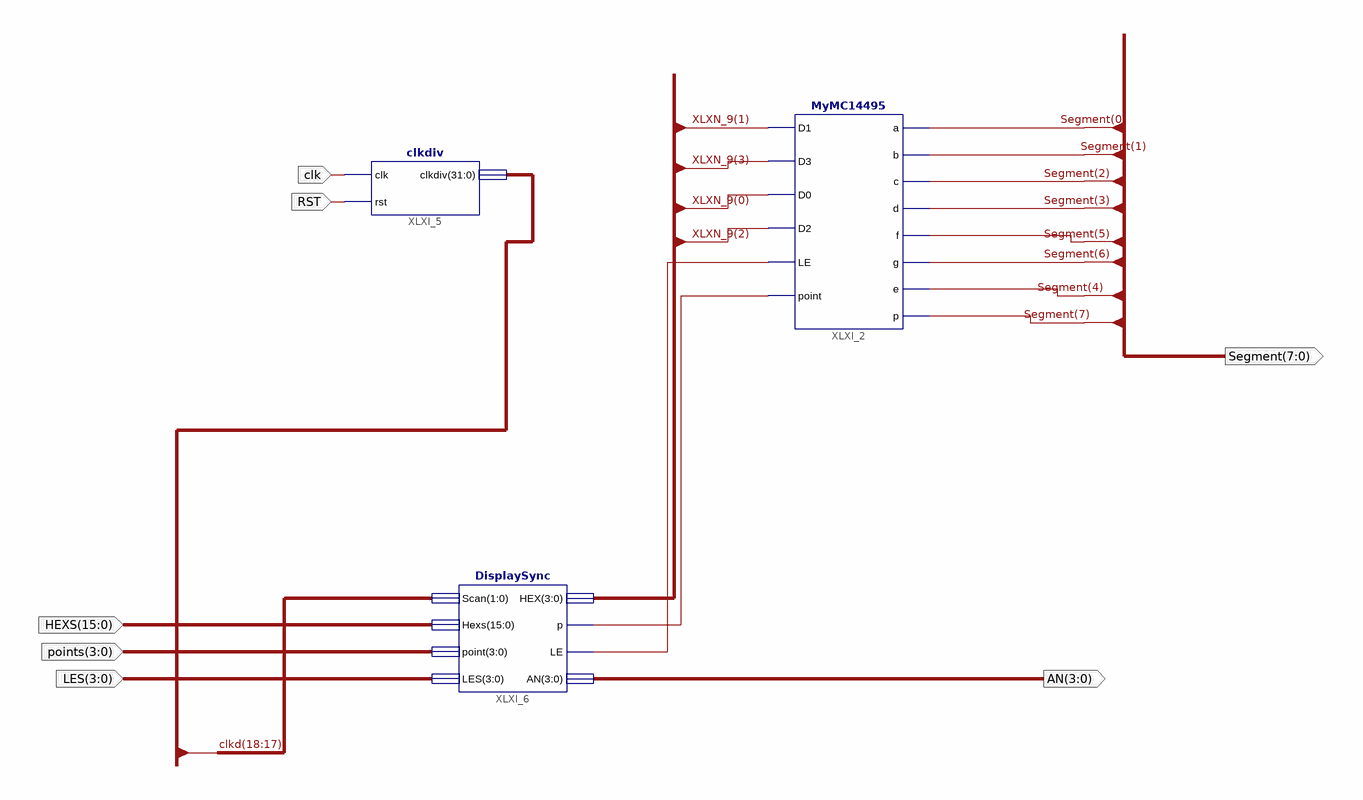
[diagram p0: schematic sheet 1]
// Xilinx ISE schematic DispNum.sch (kintex7) as structural Verilog: 3 symbols, 7 ports
module DispNum (
  input  clk,
  input  RST,
  input  [15:0] HEXS,
  input  [3:0] points,
  input  [3:0] LES,
  output [3:0] AN,
  output [7:0] Segment
);

  wire XLXN_11, XLXN_12;
  wire [3:0] XLXN_9;
  wire [31:0] clkd;

  MyMC14495 XLXI_2 (
    .D1(XLXN_9[1]), .D3(XLXN_9[3]), .D0(XLXN_9[0]), .D2(XLXN_9[2]), .LE(XLXN_12), .point(XLXN_11),
    .a(Segment[0]), .b(Segment[1]), .c(Segment[2]), .d(Segment[3]), .f(Segment[5]), .g(Segment[6]),
    .e(Segment[4]), .p(Segment[7]));
  clkdiv XLXI_5 (.clk(clk), .rst(RST), .clkdiv(clkd));
  DisplaySync XLXI_6 (
    .Scan(clkd[18:17]), .Hexs(HEXS), .point(points), .LES(LES), .HEX(XLXN_9), .p(XLXN_11), .LE(XLXN_12),
    .AN(AN));

  // Notes on the sheet:
  //   LOC on signal XLXN_9(3:0) = 
endmodule
